# Altium project Rev5.PrjPcb
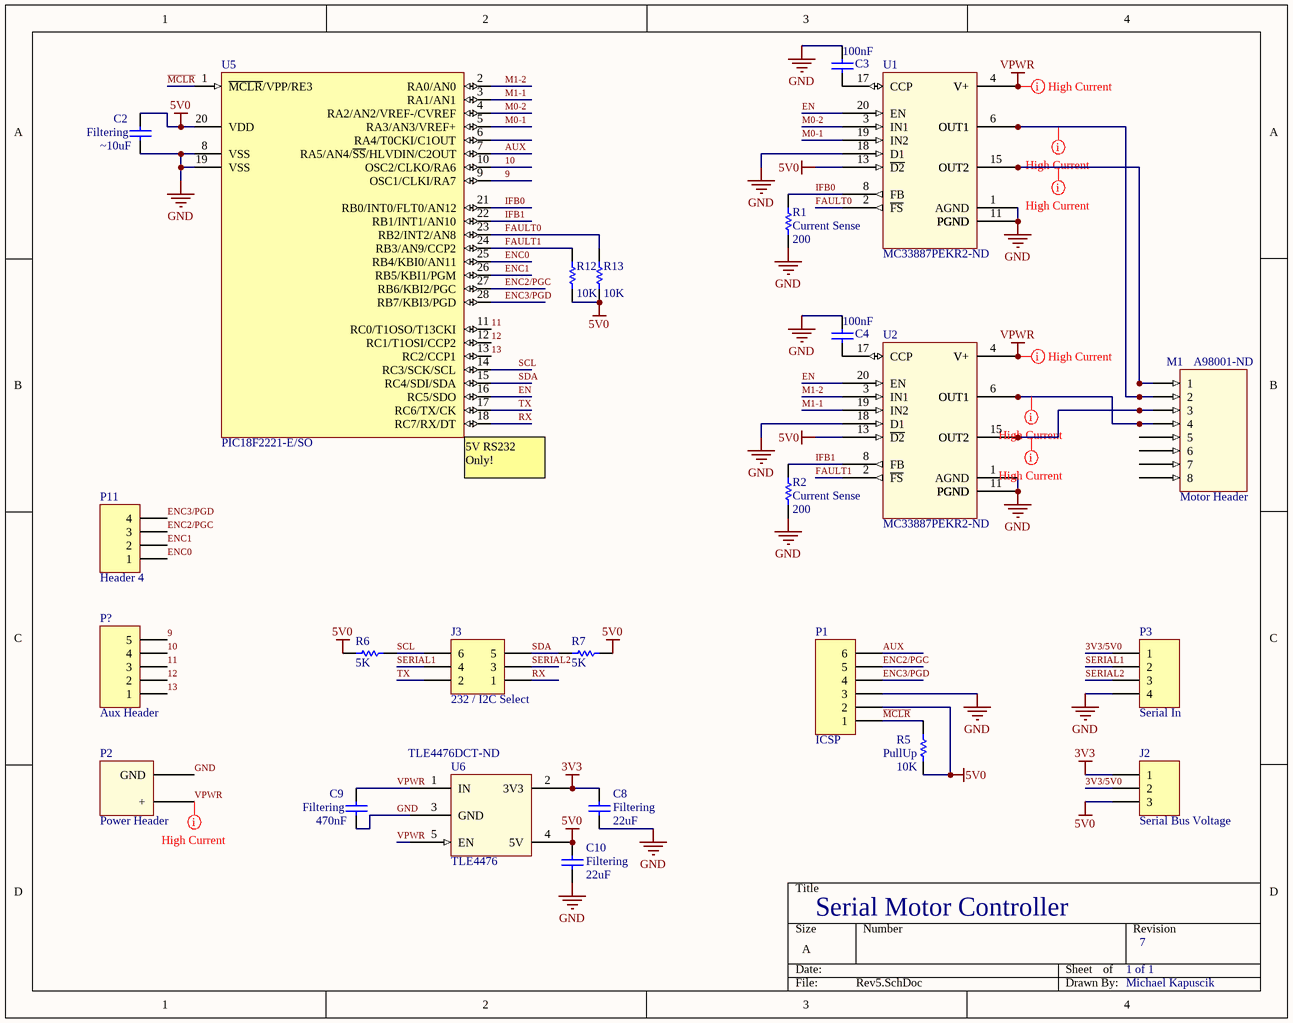
[diagram p0: Rev5.SchDoc]
1 sheet, 25 parts. Net scope: global (net labels, ports and power ports of the same name join across sheets).
Board file: Rev5.PcbDoc

## Sheet Rev5.SchDoc
size A

### Parts
C2  Filtering  value ~10uF  [CAPR2.54-5.1x3.2]
C3  value 100nF  [CAPR2.54-5.1x3.2]  (hidden comment: Cap)
C4  value 100nF  [CAPR2.54-5.1x3.2]  (hidden comment: Cap)
C8  Filtering  value 22uF  [CAPR2.54-5.1x3.2]
C9  Filtering  value 470nF  [CAPR2.54-5.1x3.2]
C10  Filtering  value 22uF  [CAPR2.54-5.1x3.2]
J2  Serial Bus Voltage  [HDR1X3]
J3  232 / I2C Select  [HDR2X3]
M1  Motor Header  Supplier Part Number 1: A98001-ND  [Motor Header]
P1  ICSP  [HDR1X6]
P2  Power Header  [Power Header]
P3  Serial In  [HDR1X4]
P11  Header 4  [HDR1X4]
P?  Aux Header  [HDR1X5]
R1  Current Sense  value 200  [AXIAL-0.3]
R2  Current Sense  value 200  [AXIAL-0.3]
R5  PullUp  value 10K  [AXIAL-0.3]
R6  value 5K  [AXIAL-0.3]  (hidden comment: Res1)
R7  value 5K  [AXIAL-0.3]  (hidden comment: Res1)
R12  value 10K  [AXIAL-0.3]  (hidden comment: PullUp)
R13  value 10K  [AXIAL-0.3]  (hidden comment: PullUp)
U1  Supplier Part Number 1: MC33887PEKR2-ND  [HSOP20 Freescale]  (hidden comment: MC33887)
U2  Supplier Part Number 1: MC33887PEKR2-ND  [HSOP20 Freescale]  (hidden comment: MC33887)
U5  PIC18F2221-E/SO  [SOIC-SO28_N]
U6  TLE4476  Supplier Part Number 1: TLE4476DCT-ND  [PG-TO252-5-1]

### Nets
3V3: C8.2 J2.1 U6.2(3V3)
5V0: C2.1 C10.2 J2.3 P1.2 R5.1 R6.2 R7.2 R12.1 R13.1 U1.13(~{D2}) U2.13(~{D2}) U5.20(VDD) U6.4(5V)
GND: C2.2 C3.1 C4.1 C8.1 C9.1 C10.1 P1.3 P2.2(GND) P3.4 R1.1 R2.1 U1.1(AGND) U1.9(PGND) U1.10(PGND) U1.11(PGND) U1.12(PGND) U1.18(D1) U1.21(PGND) U2.1(AGND) U2.9(PGND) U2.10(PGND) U2.11(PGND) U2.12(PGND) U2.18(D1) U2.21(PGND) U5.8(VSS) U5.19(VSS) U6.3(GND)
VPWR: C9.2 P2.1(+) U1.4(V+) U1.5(V+) U1.16(V+) U2.4(V+) U2.5(V+) U2.16(V+) U6.1(IN) U6.5(EN)
3V3/5V0: J2.2 P3.1
9: P?.5 U5.9(OSC1/CLKI/RA7)
10: P?.4 U5.10(OSC2/CLKO/RA6)
11: P?.3 U5.11(RC0/T1OSO/T13CKI)
12: P?.2 U5.12(RC1/T1OSI/CCP2)
13: P?.1 U5.13(RC2/CCP1)
AUX: P1.6 U5.7(RA5/AN4/~{SS}/HLVDIN/C2OUT)
EN: U1.20(EN) U2.20(EN) U5.16(RC5/SDO)
ENC0: P11.1 U5.25(RB4/KBI0/AN11)
ENC1: P11.2 U5.26(RB5/KBI1/PGM)
ENC2/PGC: P1.5 P11.3 U5.27(RB6/KBI2/PGC)
ENC3/PGD: P1.4 P11.4 U5.28(RB7/KBI3/PGD)
FAULT0: R13.2 U1.2(~{FS}) U5.23(RB2/INT2/AN8)
FAULT1: R12.2 U2.2(~{FS}) U5.24(RB3/AN9/CCP2)
IFB0: R1.2 U1.8(FB) U5.21(RB0/INT0/FLT0/AN12)
IFB1: R2.2 U2.8(FB) U5.22(RB1/INT1/AN10)
M0-1: U1.19(IN2) U5.5(RA3/AN3/VREF+)
M0-2: U1.3(IN1) U5.4(RA2/AN2/VREF-/CVREF)
M1-1: U2.19(IN2) U5.3(RA1/AN1)
M1-2: U2.3(IN1) U5.2(RA0/AN0)
~{MCLR}: P1.1 R5.2 U5.1(~{MCLR}/VPP/RE3)
RX: J3.1 U5.18(RC7/RX/DT)
SCL: J3.6 R6.1 U5.14(RC3/SCK/SCL)
SDA: J3.5 R7.1 U5.15(RC4/SDI/SDA)
SERIAL1: J3.4 P3.2
SERIAL2: J3.3 P3.3
TX: J3.2 U5.17(RC6/TX/CK)
NetC3_2: C3.2 U1.17(CCP)
NetC4_2: C4.2 U2.17(CCP)
NetM1_1: M1.1 U1.14(OUT2) U1.15(OUT2)
NetM1_2: M1.2 U1.6(OUT1) U1.7(OUT1)
NetM1_3: M1.3 U2.14(OUT2) U2.15(OUT2)
NetM1_4: M1.4 U2.6(OUT1) U2.7(OUT1)

Not connected (* = marked no-connect by the designer): M1 5 6 7 8; U5 6(RA4/T0CKI/C1OUT)

### Layout directives
net class High Current: NetM1_1, NetM1_2, NetM1_3, NetM1_4, VPWR

### Notes on the sheet
- (near U5) 5V RS232 Only!
- Serial Motor Controller
- 1 of 1
- 7
- Michael Kapuscik

### Library data of the parts
C2-C4 C8-C10 = Cap: Capacitor; Published: 8-Jun-2000; LatestRevisionDate: 17-Jul-2002; LatestRevisionNote: Re-released for DXP Platform.; PackageReference: RAD-0.3; Publisher: Altium Limited; Supplier 1: Digi-Key
  C2-C4: Supplier Part Number 1: 490-5401-ND
  C8 C10: Supplier Part Number 1: P905-ND
  C9: Supplier Part Number 1: P929-ND
J2 = Header 3: Header, 3-Pin; LatestRevisionDate: 17-Jul-2002; LatestRevisionNote: Re-released for DXP Platform.; Publisher: Altium Limited
J3 = Header 3X2: Header, 3-Pin, Dual row; LatestRevisionDate: 17-Jul-2002; LatestRevisionNote: Re-released for DXP Platform.; Publisher: Altium Limited
P1 = Header 6: Header, 6-Pin; LatestRevisionDate: 17-Jul-2002; LatestRevisionNote: Re-released for DXP Platform.; Publisher: Altium Limited
P3 P11 = Header 4: Header, 4-Pin; LatestRevisionDate: 17-Jul-2002; LatestRevisionNote: Re-released for DXP Platform.; Publisher: Altium Limited
  P3: Supplier 1: Digi-Key; Supplier Part Number 1: A26509-40-ND
P? = Header 5: Header, 5-Pin; LatestRevisionDate: 17-Jul-2002; LatestRevisionNote: Re-released for DXP Platform.; Publisher: Altium Limited
R1 = Res1: 1% Non Wirewound; Published: 8-Jun-2000; LatestRevisionDate: 17-Jul-2002; LatestRevisionNote: Re-released for DXP Platform.; PackageReference: AXIAL-0.3; Publisher: Altium Limited; Supplier 1: Digi-Key; Supplier Part Number 1: RNF14FTD200RCT-ND
R2 R5-R7 R12 R13 = Res1: Resistor; Published: 8-Jun-2000; LatestRevisionDate: 17-Jul-2002; LatestRevisionNote: Re-released for DXP Platform.; PackageReference: AXIAL-0.3; Publisher: Altium Limited
  R2: Supplier 1: Digi-Key; Supplier Part Number 1: RNF14FTD200RCT-ND
  R5: Supplier 1: Digi-Key; Supplier Part Number 1: CF14JT10K0CT-ND
  R6 R7: Supplier 1: Digi-Key; Supplier Part Number 1: CF18JT5K60CT-ND
U1 U2 = MC33887: H-Bridge; Supplier 1: Digi-Key
U5 = PIC18F2221-E/SO: Enhanced Flash Microcontroller with 10-Bit A/D and nanoWatt Technology, 4K Flash, 28-Pin SOIC, Extended Temperature Range; FirstPublished: 29-Jan-2009; DatasheetVersion: revE, Feb-2007; PackageVersion: revBB, Aug-2009; PackageReference: SOIC-SO28; Publisher: Altium Limited; PackageDescription: 28-Lead Plastic Small Outline (SO) - Wide 7.50mm Body [SOIC]; Supplier 1: Newark; Supplier Part Number 1: 54M5014; Code_JEDEC: MS-013; ComponentLink1Description: Datasheet; ComponentLink1URL: http://ww1.microchip.com/downloads/en/DeviceDoc/39689E.pdf; ComponentLink2Description: Packaging Specification; ComponentLink2URL: http://www.microchip.com/stellent/groups/techpub_sg/documents/packagingspec/en012702.pdf; ComponentLink3Description: Microchip.com Home; ComponentLink3URL: http://www.microchip.com/; Supplier 2: Digi-Key; Supplier Part Number 2: PIC18F2221-I/SO-ND
U6 = TLE4476: 3V3 / 5V0 LDO regulator; Supplier 1: Digi-Key
M1 = Motor Header: Supplier 1: Digi-Key

## Assembly variants
Test Varrian: not fitted P3